# EAGLE design CableAdapter (EAGLE 7.0.0)
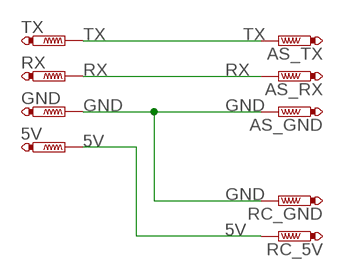
[diagram p0: schematic, sheet 1]

## Parts
5V  PTR1TP20SQ  [TP20SQ]
AS_GND  PTR1TP20SQ  [TP20SQ]
AS_RX  PTR1TP20SQ  [TP20SQ]
AS_TX  PTR1TP20SQ  [TP20SQ]
GND  PTR1TP20SQ  [TP20SQ]
RC_5V  PTR1TP20SQ  [TP20SQ]
RC_GND  PTR1TP20SQ  [TP20SQ]
RX  PTR1TP20SQ  [TP20SQ]
TX  PTR1TP20SQ  [TP20SQ]

## Nets
5V: 5V.TP RC_5V.TP
GND: AS_GND.TP GND.TP RC_GND.TP
RX: AS_RX.TP RX.TP
TX: AS_TX.TP TX.TP

## Library data of the parts
5V AS_GND AS_RX AS_TX GND RC_5V RC_GND RX TX = testpad:PTR1: TEST PIN

## Board
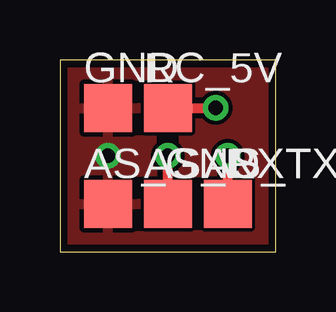
[diagram p1: board, top side]
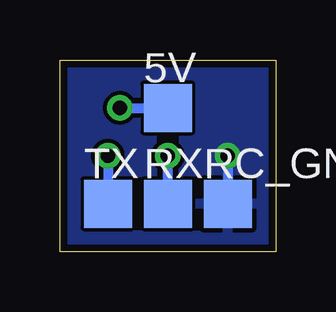
[diagram p2: board, bottom side, seen from below]

Size 9 x 8 mm. Coordinates in mm from the lower left corner, seen from the top.
Outline: 0,0 9,0 9,8 0,8 0,0
Copper layers (1*16): Top 0.035mm / dielectric 1.5mm / Bottom 0.035mm
Design rules "PCB-POOL Standard": minimum track width 0.15mm, minimum drill 0.3mm, track to track 0.15mm, track to pad 0.15mm, pad to pad 0.15mm, via to via 0.15mm, smd to smd 0.15mm, copper to edge 0.3mm, drill to drill 0.2mm, minimum pad ring 0.2mm, minimum via ring 0.15mm, stop-mask expansion 0.075mm, vias tented up to drill 0mil, thermal gap 0.2mm

### Footprints (pad centres in the part's own frame; a part is rotated, then mirrored left to right if it is on the bottom)
TP20SQ = smd 2 x 2: TP 0,0

### Placement (x,y rotation side)
5V  4.5,6 0 bottom
AS_GND  2,2 0 top
AS_RX  4.5,2 0 top
AS_TX  7,2 0 top
GND  2,6 0 top
RC_5V  4.5,6 0 top
RC_GND  2,2 0 bottom
RX  4.5,2 0 bottom
TX  7,2 0 bottom

### Tracks (layer width: path | path; a pad name or v marks a point on that pad's centre or on a via)
5V  (via drill 0.6 pad 0.25)
  Top 0.406: 5V.TP v6.5,6
  Bottom 0.406: v6.5,6 5V.TP
GND  (via drill 0.6 pad 0.25)
  Top 0.406: 2,4.1 1.9,4.1 v2,4
  Bottom 0.406: v2,4 AS_GND.TP
  pour Top: 0,10 10,10 10,0 0,0
  pour Bottom: 0,10 10,10 10,0 0,0
RX  (via drill 0.6 pad 0.25)
  Top 0.406: AS_RX.TP v4.5,4
  Bottom 0.406: 4.4,2 AS_RX.TP v4.5,4
TX  (via drill 0.6 pad 0.25)
  Top 0.406: AS_TX.TP v7,4
  Bottom 0.406: v7,4 AS_TX.TP